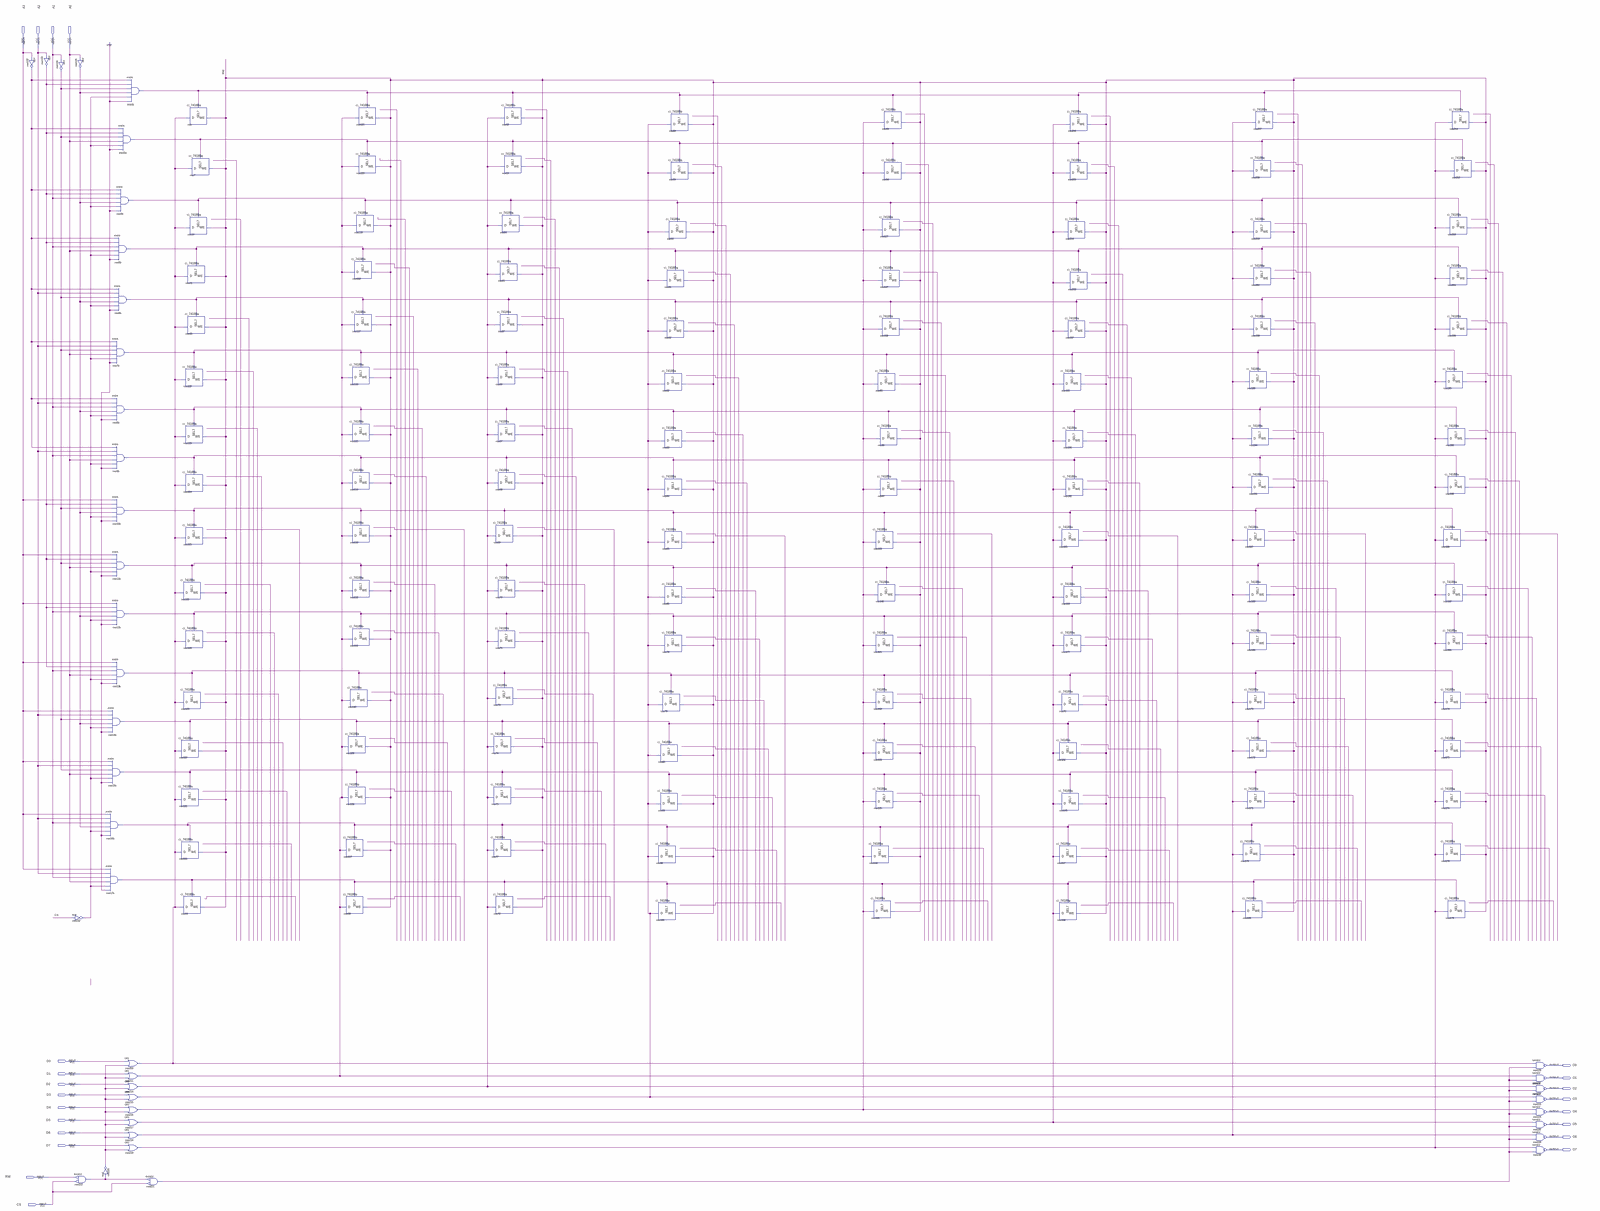
[diagram p0: schematic sheet, whole]
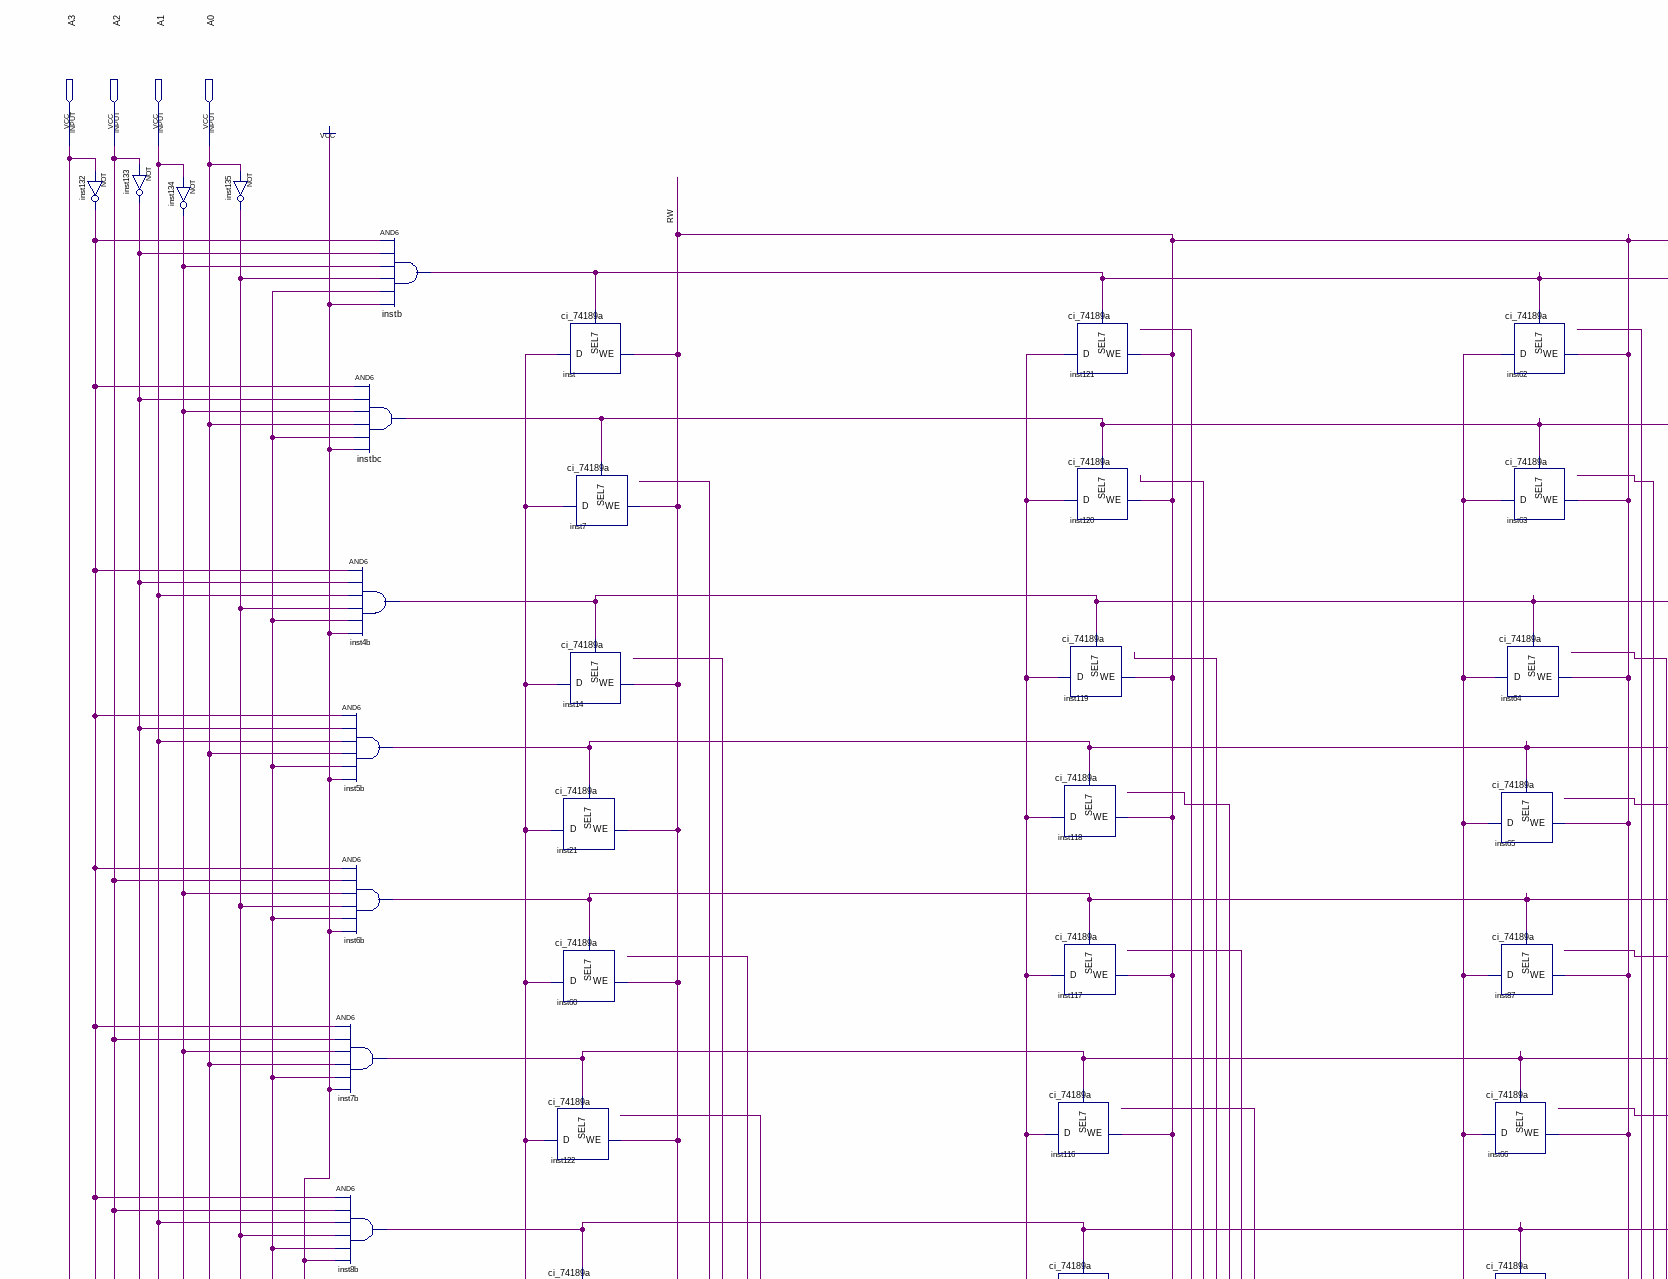
[diagram p1: schematic sheet, upper left part]
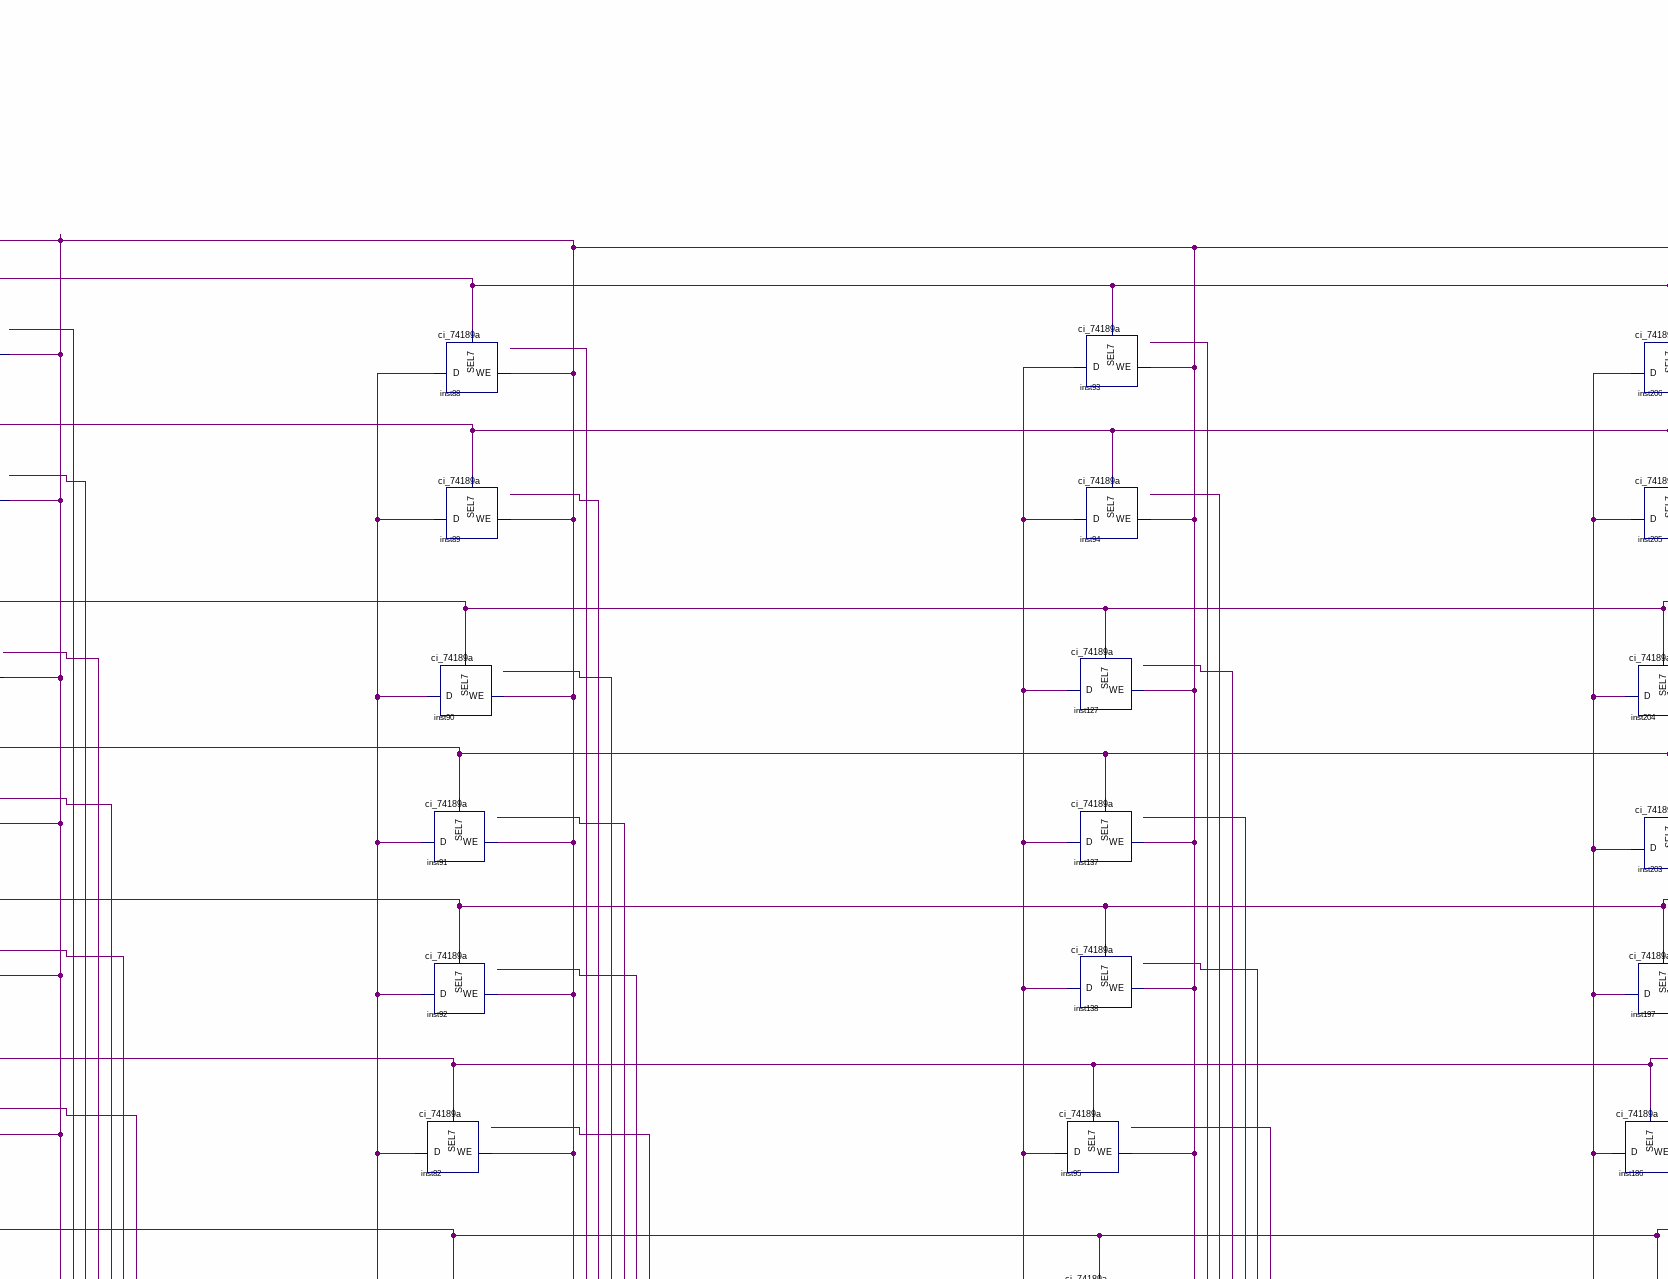
[diagram p2: schematic sheet, upper centre part]
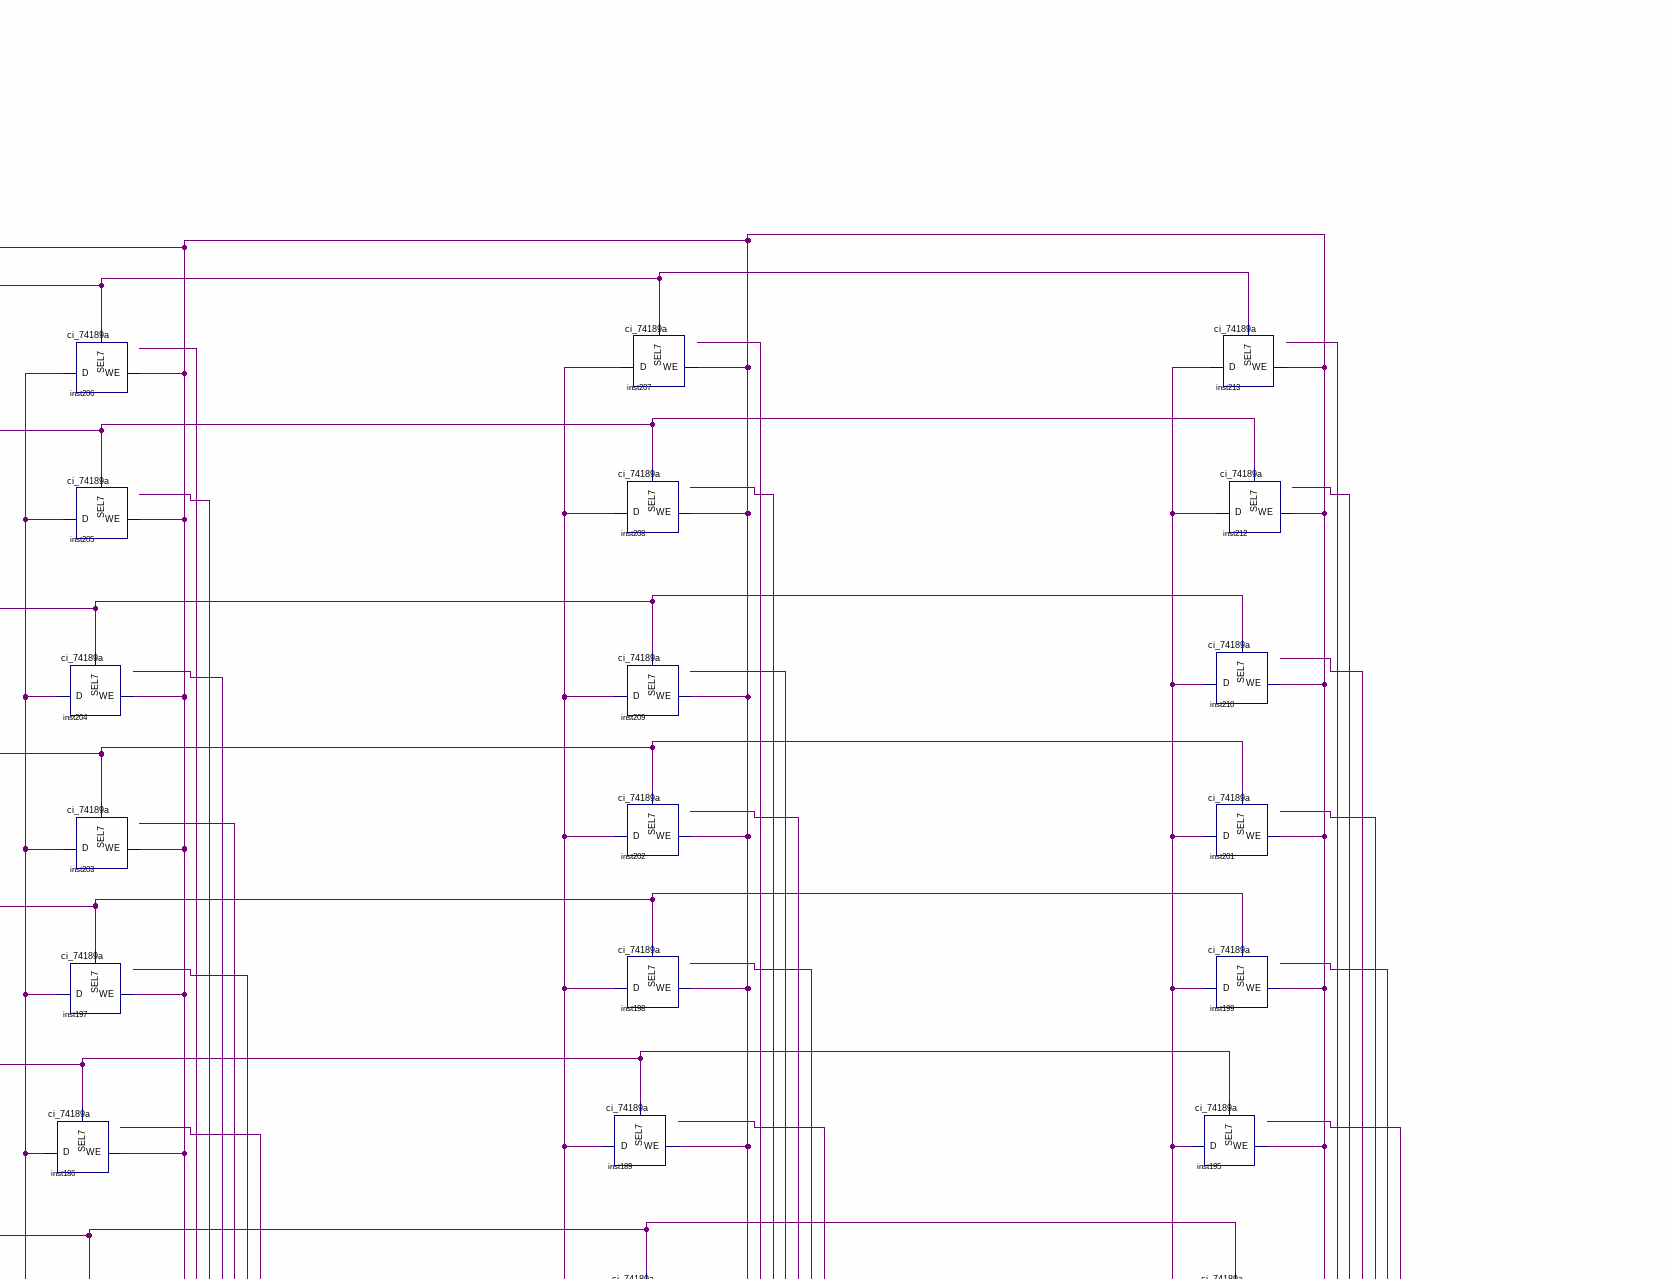
[diagram p3: schematic sheet, upper right part]
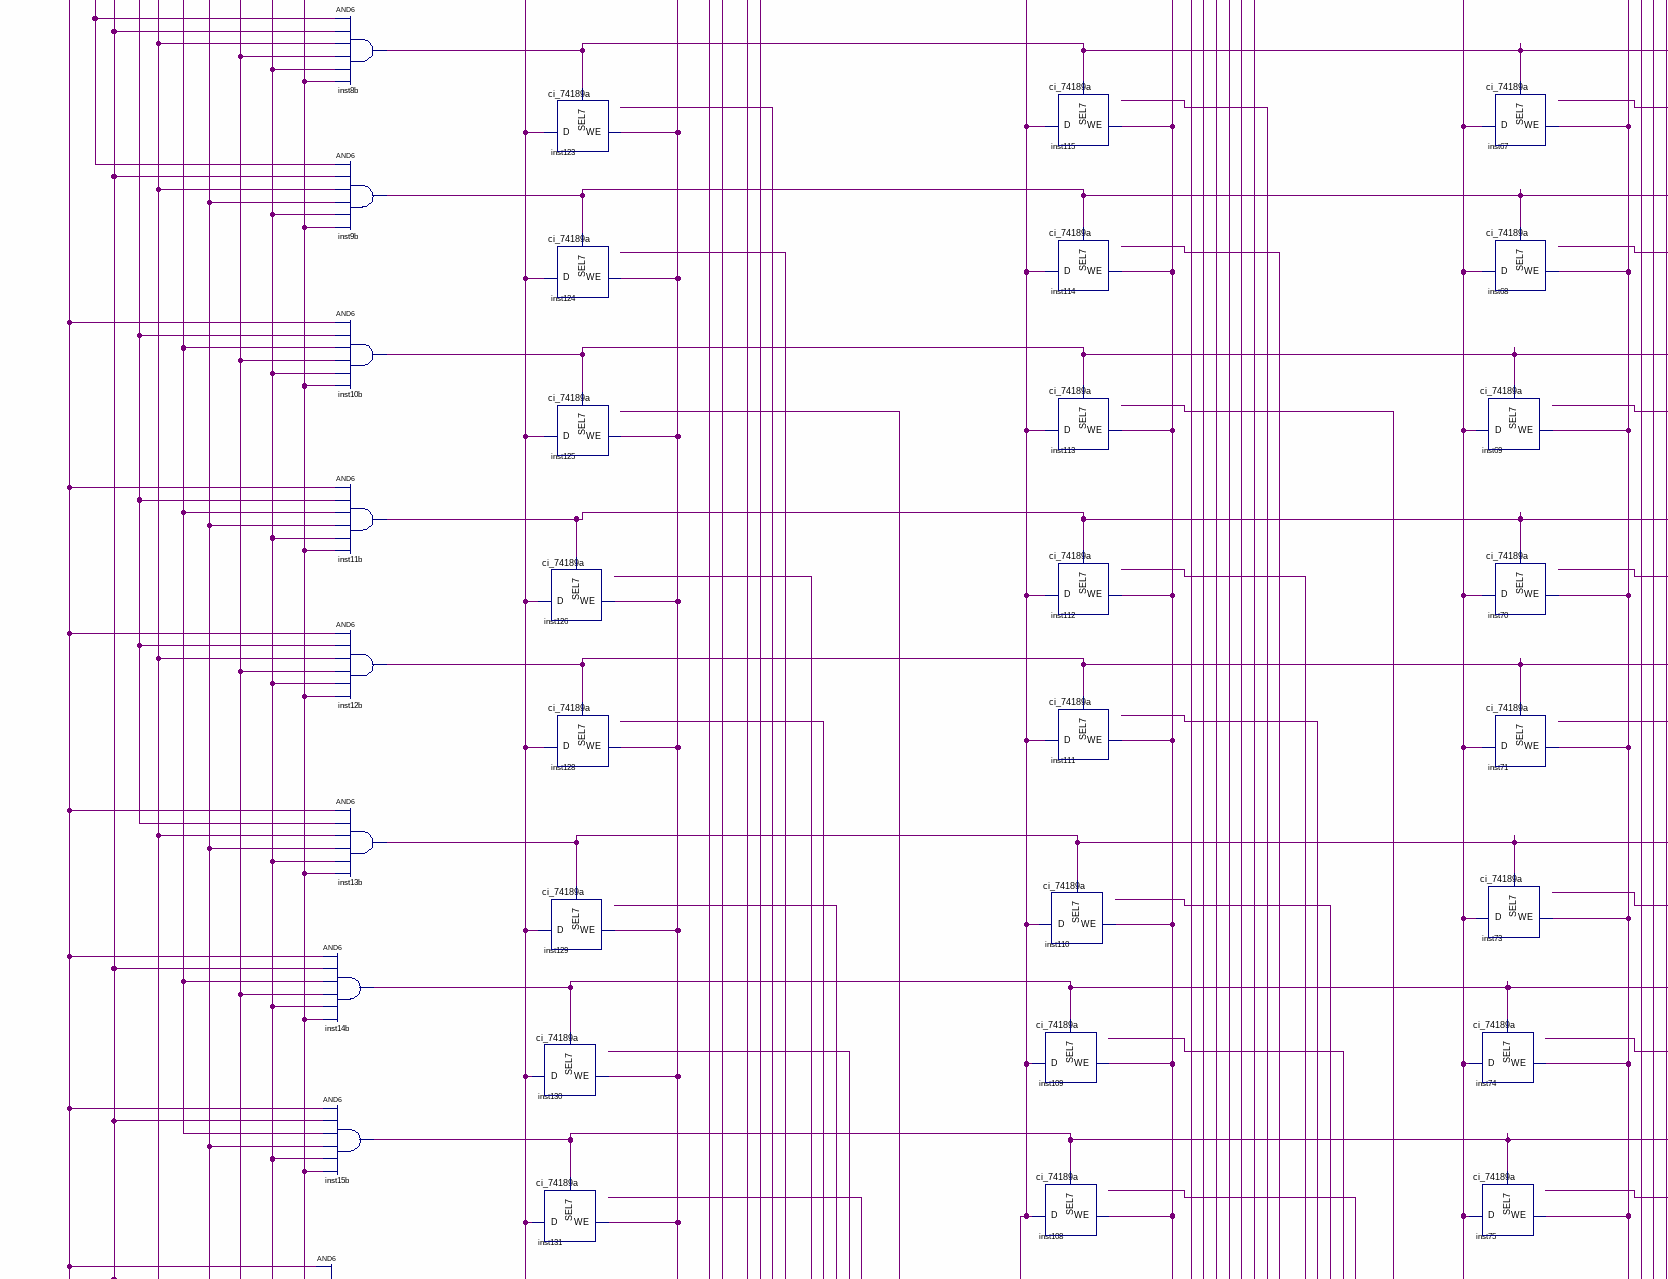
[diagram p4: schematic sheet, middle left part]
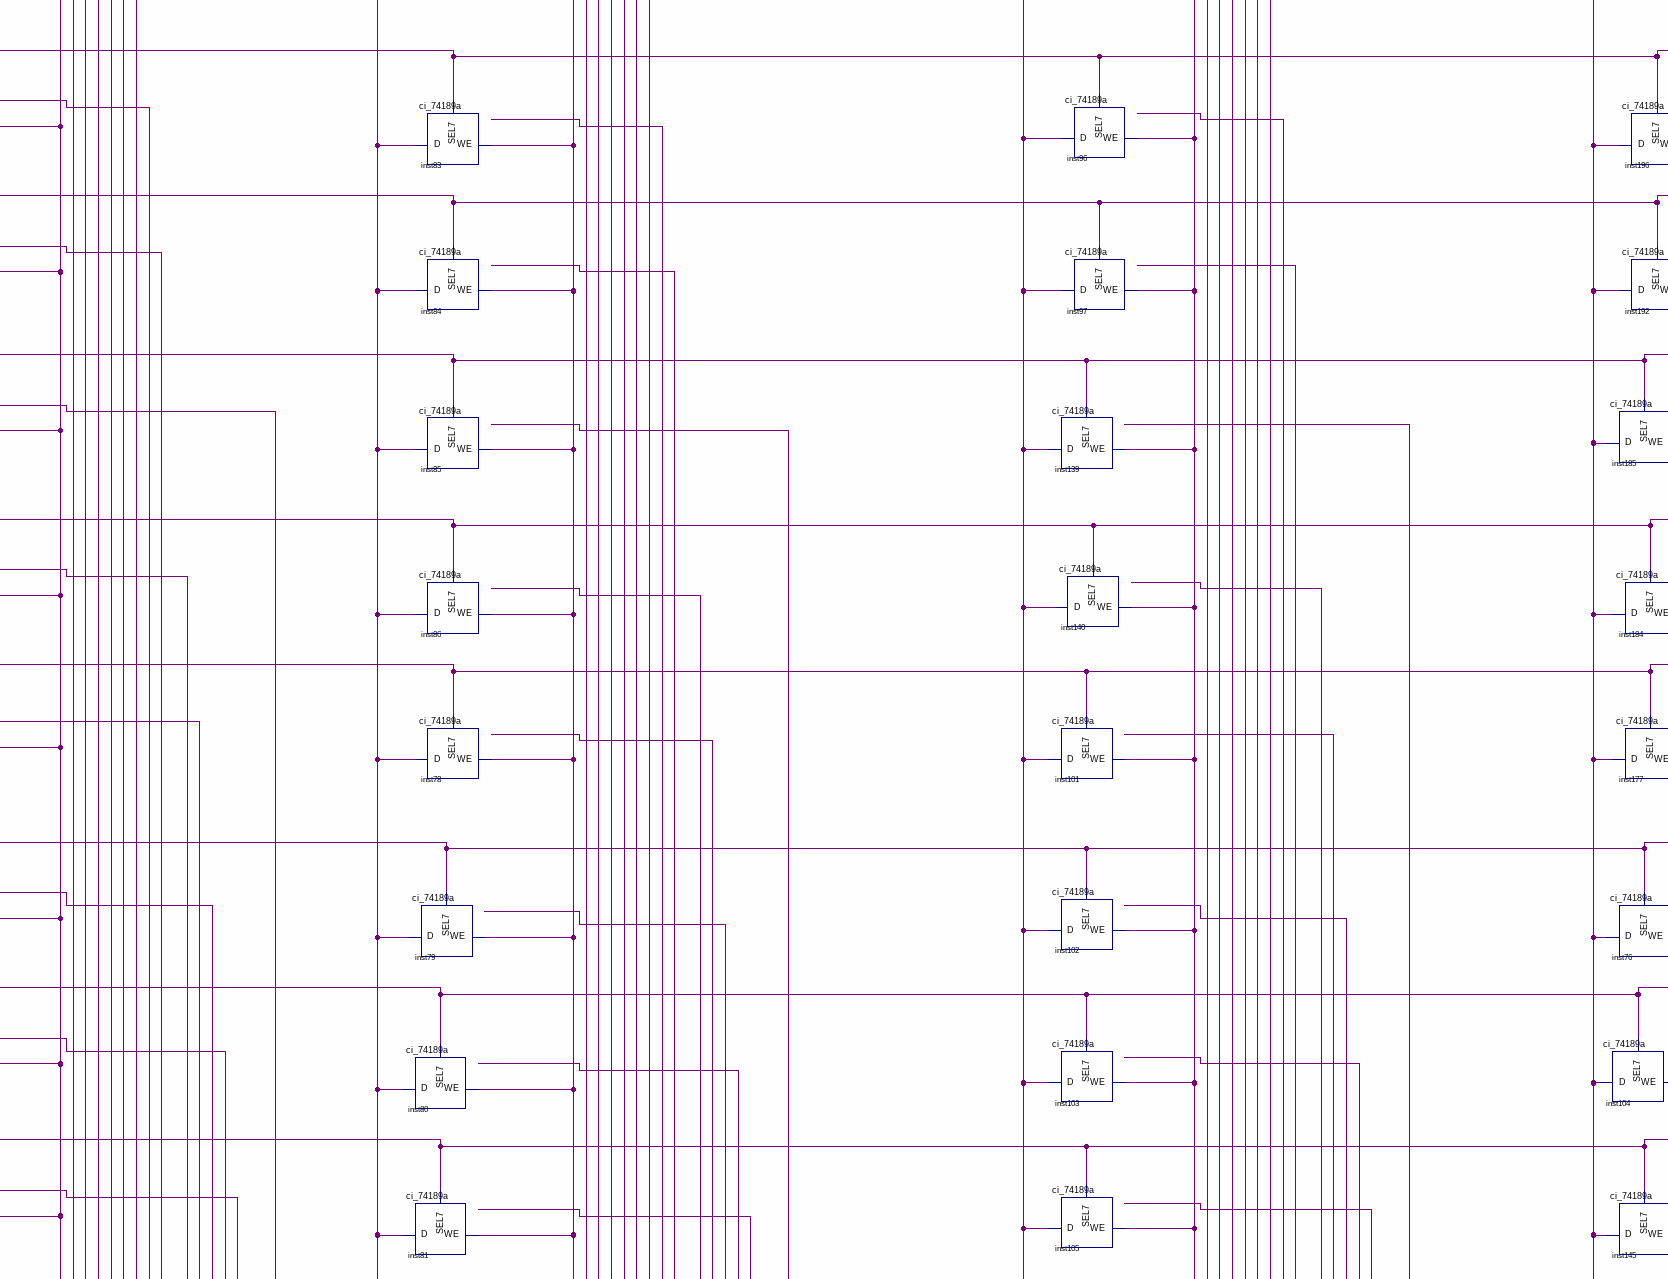
[diagram p5: schematic sheet, middle centre part]
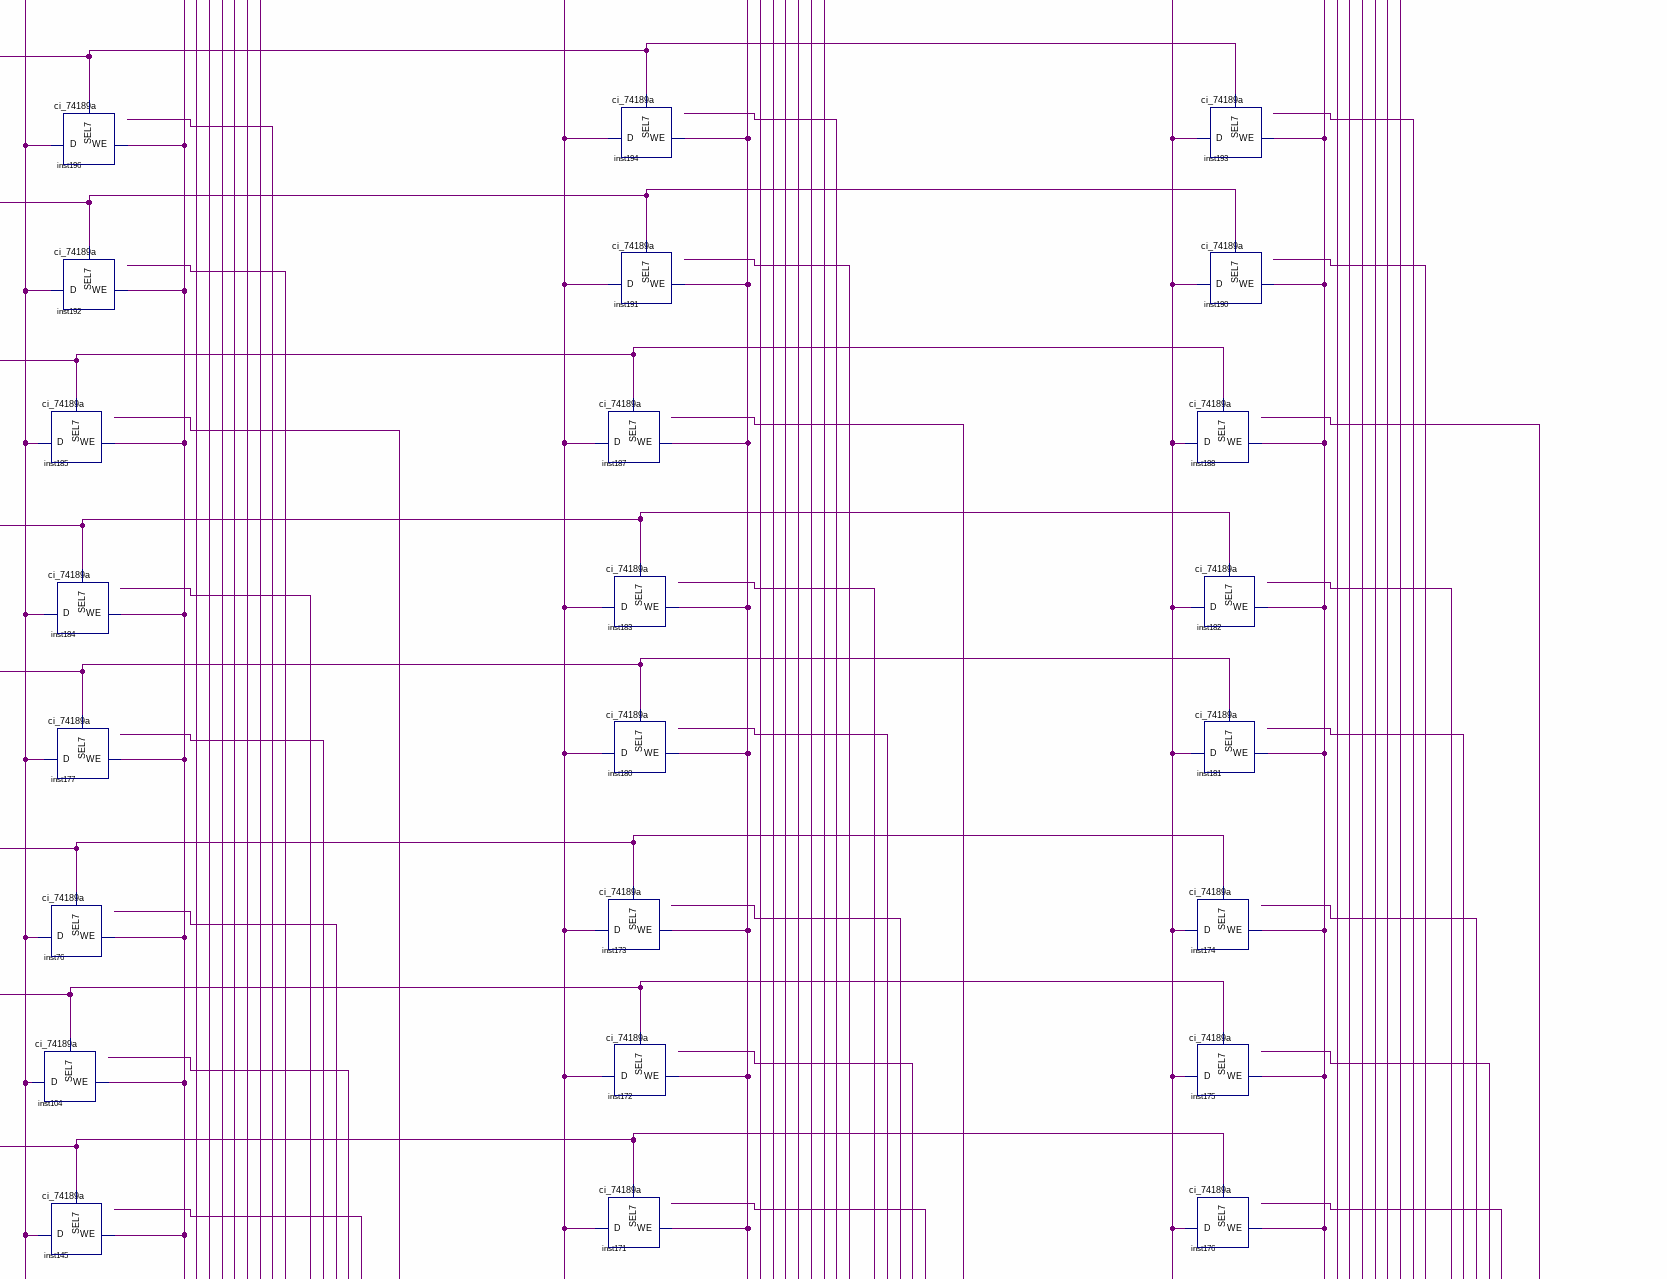
[diagram p6: schematic sheet, middle right part]
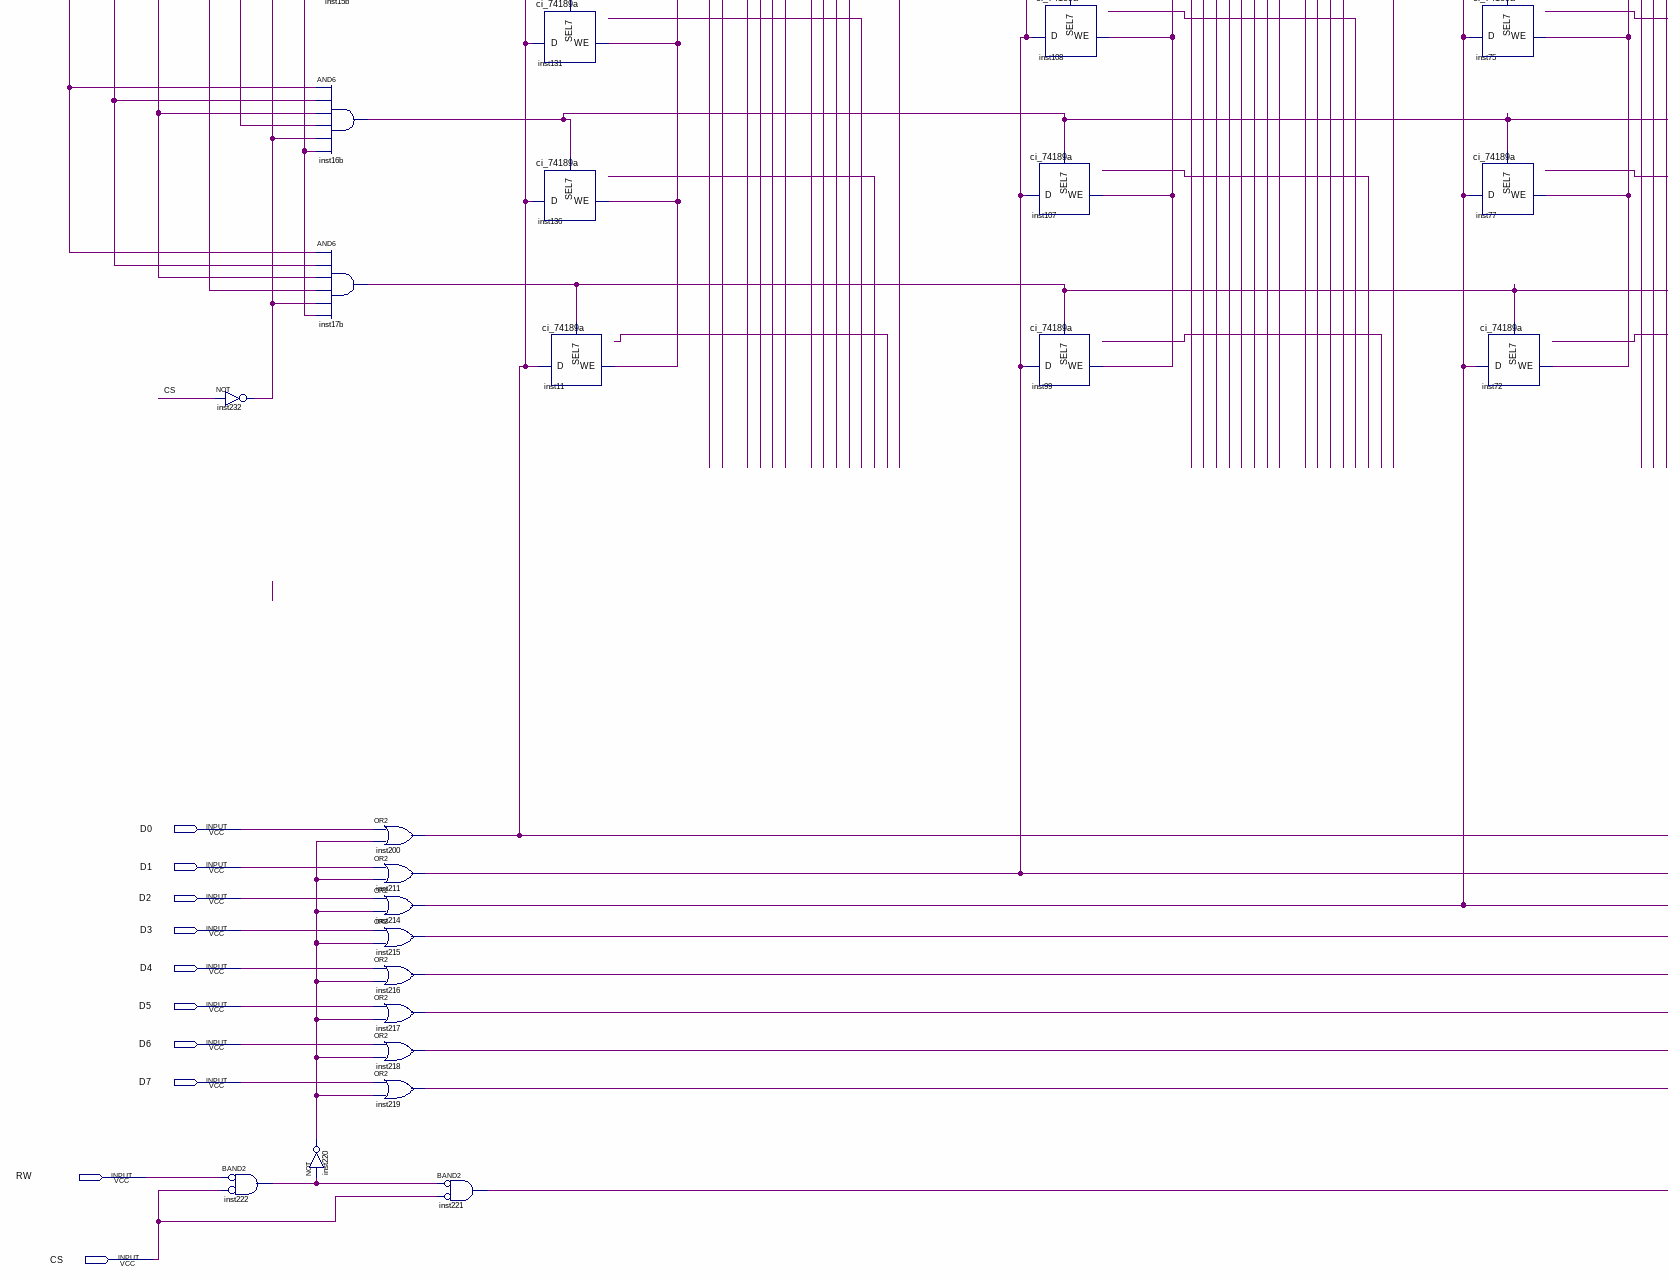
[diagram p7: schematic sheet, lower left part]
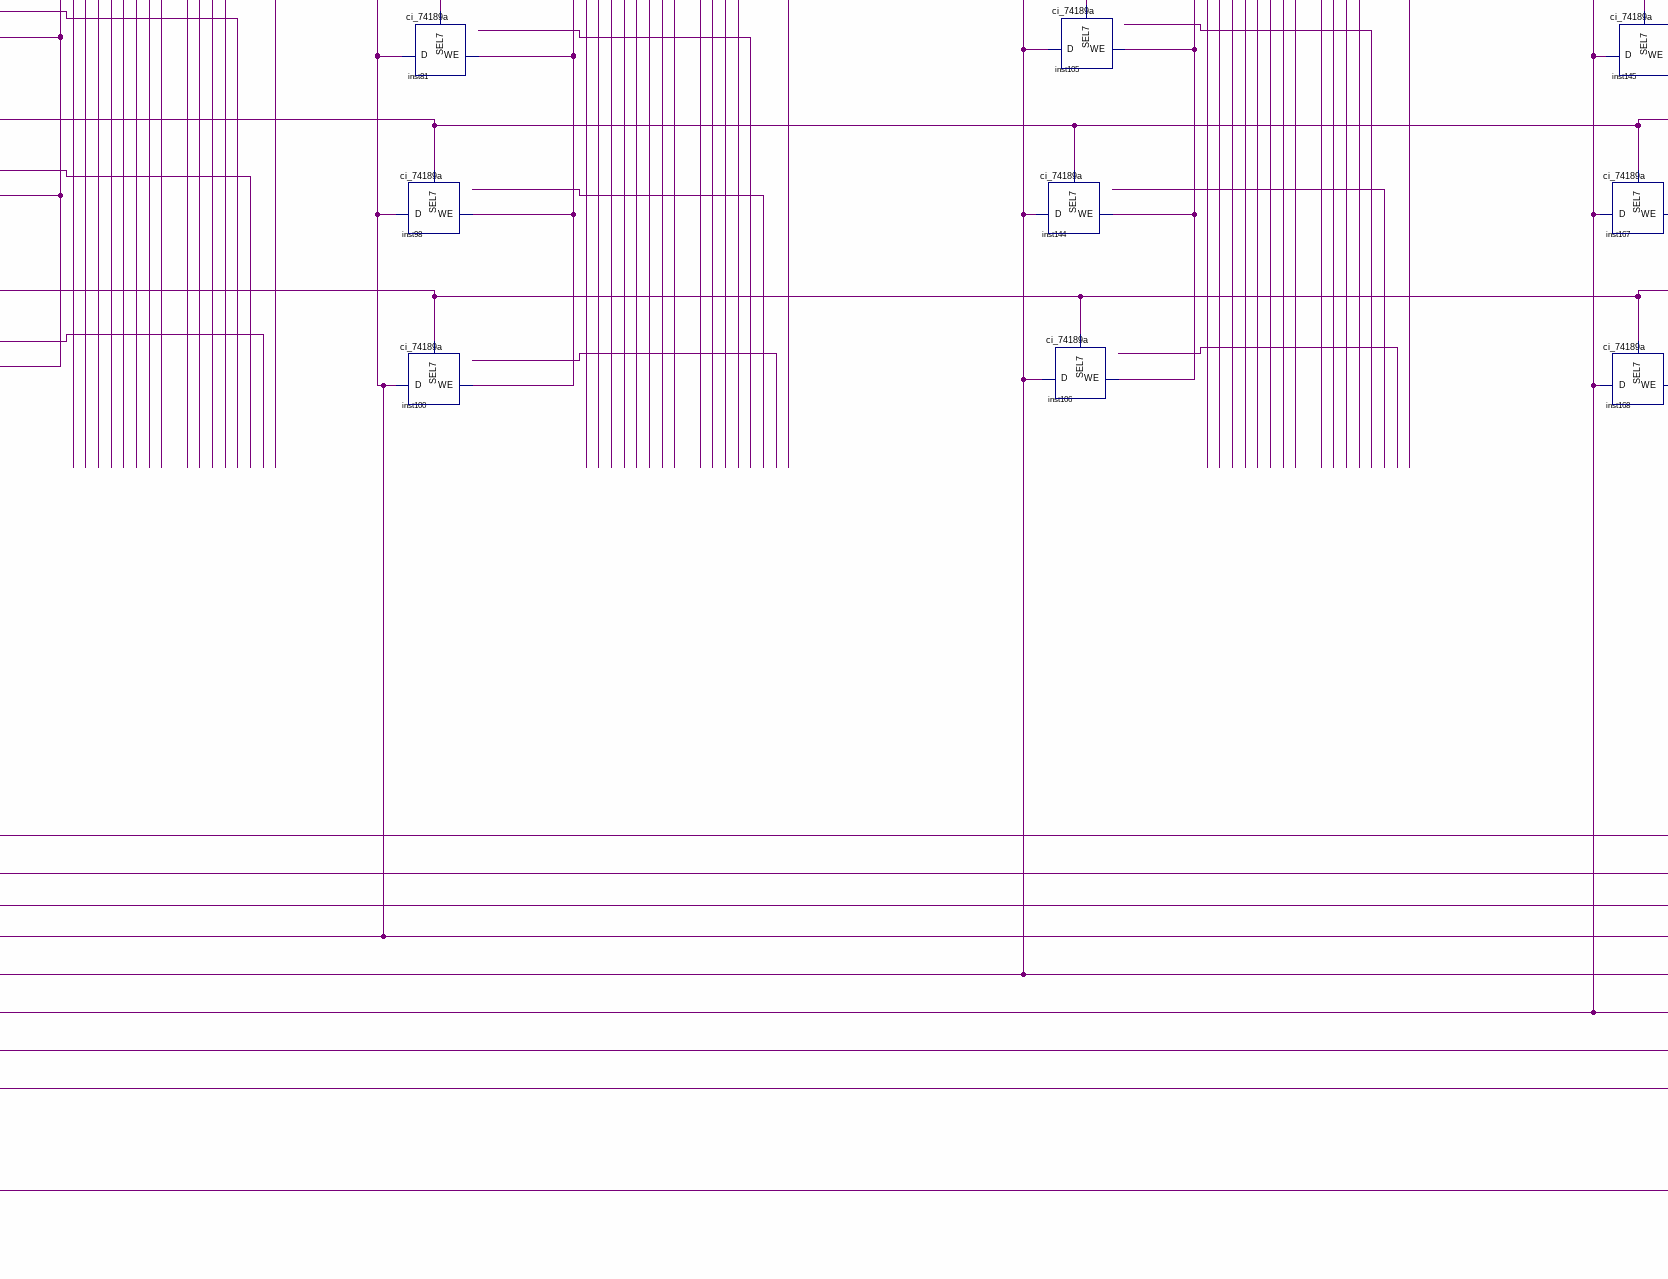
[diagram p8: schematic sheet, lower centre part]
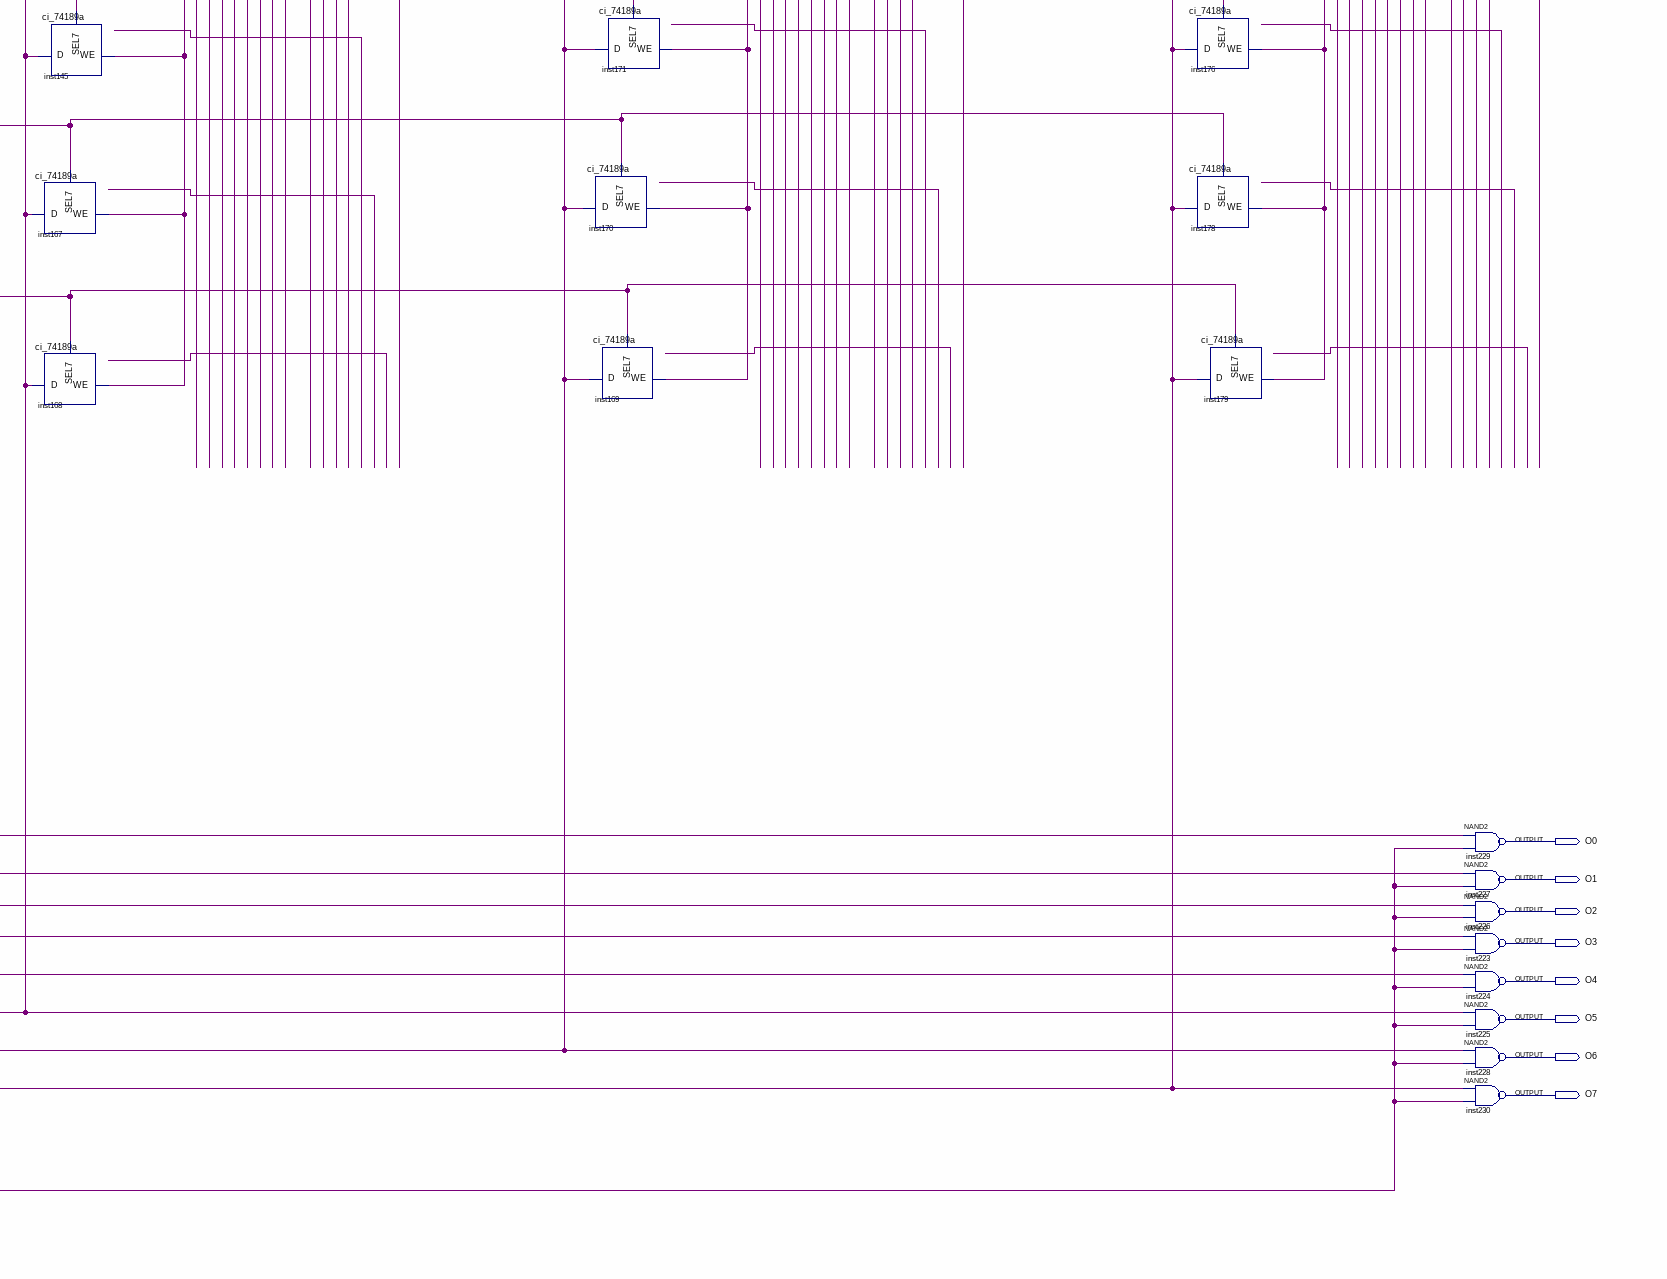
[diagram p9: schematic sheet, lower right part]
// Quartus schematic ram16x8a.bdf as structural Verilog: 168 symbols, 22 pins
module ram16x8a (
  input  A3,
  input  A2,
  input  A1,
  input  A0,
  input  D0,
  input  D1,
  input  D2,
  input  D3,
  input  D4,
  input  D5,
  input  D6,
  input  D7,
  input  RW,
  input  CS,
  output O0,
  output O1,
  output O2,
  output O3,
  output O4,
  output O5,
  output O6,
  output O7
);

  wire inst4b_out, inst5b_out, inst6b_out, inst7b_out, inst8b_out, inst9b_out, inst10b_out, inst11b_out,
       inst12b_out, inst13b_out, inst14b_out, inst15b_out, inst16b_out, inst17b_out, inst132_out,
       inst133_out, inst134_out, inst135_out, inst200_out, inst211_out, inst214_out, inst215_out,
       inst216_out, inst217_out, inst218_out, inst219_out, inst220_out, inst221_out, inst222_out,
       inst232_out, instb_out, instbc_out;

  not inst132 (inst132_out, A3);
  not inst133 (inst133_out, A2);
  not inst134 (inst134_out, A1);
  not inst135 (inst135_out, A0);
  not inst232 (inst232_out, CS);
  and inst222 (inst222_out, ~RW, ~CS);  // BAND2
  and inst4b (inst4b_out, inst132_out, inst133_out, A1, inst135_out, inst232_out, 1'b1);
  and inst5b (inst5b_out, inst132_out, inst133_out, A1, A0, inst232_out, 1'b1);
  and inst6b (inst6b_out, inst132_out, A2, inst134_out, inst135_out, inst232_out, 1'b1);
  and inst7b (inst7b_out, inst132_out, A2, inst134_out, A0, inst232_out, 1'b1);
  and inst8b (inst8b_out, inst132_out, A2, A1, inst135_out, inst232_out, 1'b1);
  and inst9b (inst9b_out, inst132_out, A2, A1, A0, inst232_out, 1'b1);
  and inst10b (inst10b_out, A3, inst133_out, inst134_out, inst135_out, inst232_out, 1'b1);
  and inst11b (inst11b_out, A3, inst133_out, inst134_out, A0, inst232_out, 1'b1);
  and inst12b (inst12b_out, A3, inst133_out, A1, inst135_out, inst232_out, 1'b1);
  and inst13b (inst13b_out, A3, inst133_out, A1, A0, inst232_out, 1'b1);
  and inst14b (inst14b_out, A3, A2, inst134_out, inst135_out, inst232_out, 1'b1);
  and inst15b (inst15b_out, A3, A2, inst134_out, A0, inst232_out, 1'b1);
  and inst16b (inst16b_out, A3, A2, A1, inst135_out, inst232_out, 1'b1);
  and inst17b (inst17b_out, A3, A2, A1, A0, inst232_out, 1'b1);
  not inst220 (inst220_out, inst222_out);
  and instb (instb_out, inst132_out, inst133_out, inst134_out, inst135_out, inst232_out, 1'b1);
  and instbc (instbc_out, inst132_out, inst133_out, inst134_out, A0, inst232_out, 1'b1);
  or inst200 (inst200_out, D0, inst220_out);
  or inst211 (inst211_out, D1, inst220_out);
  or inst214 (inst214_out, D2, inst220_out);
  or inst215 (inst215_out, D3, inst220_out);
  or inst216 (inst216_out, D4, inst220_out);
  or inst217 (inst217_out, D5, inst220_out);
  or inst218 (inst218_out, D6, inst220_out);
  or inst219 (inst219_out, D7, inst220_out);
  and inst221 (inst221_out, ~inst222_out, ~CS);  // BAND2
  ci_74189a inst21 (.WE(RW), .SEL7(inst5b_out), .D(inst200_out));
  ci_74189a inst60 (.WE(RW), .SEL7(inst6b_out), .D(inst200_out));
  ci_74189a inst122 (.WE(RW), .SEL7(inst7b_out), .D(inst200_out));
  ci_74189a inst123 (.WE(RW), .SEL7(inst8b_out), .D(inst200_out));
  ci_74189a inst124 (.WE(RW), .SEL7(inst9b_out), .D(inst200_out));
  ci_74189a inst125 (.WE(RW), .SEL7(inst10b_out), .D(inst200_out));
  ci_74189a inst126 (.WE(RW), .SEL7(inst11b_out), .D(inst200_out));
  ci_74189a inst128 (.WE(RW), .SEL7(inst12b_out), .D(inst200_out));
  ci_74189a inst129 (.WE(RW), .SEL7(inst13b_out), .D(inst200_out));
  ci_74189a inst130 (.WE(RW), .SEL7(inst14b_out), .D(inst200_out));
  ci_74189a inst131 (.WE(RW), .SEL7(inst15b_out), .D(inst200_out));
  ci_74189a inst136 (.WE(RW), .SEL7(inst16b_out), .D(inst200_out));
  ci_74189a inst11 (.WE(RW), .SEL7(inst17b_out), .D(inst200_out));
  ci_74189a inst (.WE(RW), .SEL7(instb_out), .D(inst200_out));
  ci_74189a inst7 (.WE(RW), .SEL7(instbc_out), .D(inst200_out));
  ci_74189a inst14 (.WE(RW), .SEL7(inst4b_out), .D(inst200_out));
  ci_74189a inst119 (.WE(RW), .SEL7(inst4b_out), .D(inst211_out));
  ci_74189a inst118 (.WE(RW), .SEL7(inst5b_out), .D(inst211_out));
  ci_74189a inst117 (.WE(RW), .SEL7(inst6b_out), .D(inst211_out));
  ci_74189a inst116 (.WE(RW), .SEL7(inst7b_out), .D(inst211_out));
  ci_74189a inst115 (.WE(RW), .SEL7(inst8b_out), .D(inst211_out));
  ci_74189a inst114 (.WE(RW), .SEL7(inst9b_out), .D(inst211_out));
  ci_74189a inst113 (.WE(RW), .SEL7(inst10b_out), .D(inst211_out));
  ci_74189a inst112 (.WE(RW), .SEL7(inst11b_out), .D(inst211_out));
  ci_74189a inst111 (.WE(RW), .SEL7(inst12b_out), .D(inst211_out));
  ci_74189a inst110 (.WE(RW), .SEL7(inst13b_out), .D(inst211_out));
  ci_74189a inst109 (.WE(RW), .SEL7(inst14b_out), .D(inst211_out));
  ci_74189a inst108 (.WE(RW), .SEL7(inst15b_out), .D(inst211_out));
  ci_74189a inst107 (.WE(RW), .SEL7(inst16b_out), .D(inst211_out));
  ci_74189a inst99 (.WE(RW), .SEL7(inst17b_out), .D(inst211_out));
  ci_74189a inst121 (.WE(RW), .SEL7(instb_out), .D(inst211_out));
  ci_74189a inst120 (.WE(RW), .SEL7(instbc_out), .D(inst211_out));
  ci_74189a inst62 (.WE(RW), .SEL7(instb_out), .D(inst214_out));
  ci_74189a inst63 (.WE(RW), .SEL7(instbc_out), .D(inst214_out));
  ci_74189a inst64 (.WE(RW), .SEL7(inst4b_out), .D(inst214_out));
  ci_74189a inst65 (.WE(RW), .SEL7(inst5b_out), .D(inst214_out));
  ci_74189a inst87 (.WE(RW), .SEL7(inst6b_out), .D(inst214_out));
  ci_74189a inst66 (.WE(RW), .SEL7(inst7b_out), .D(inst214_out));
  ci_74189a inst67 (.WE(RW), .SEL7(inst8b_out), .D(inst214_out));
  ci_74189a inst68 (.WE(RW), .SEL7(inst9b_out), .D(inst214_out));
  ci_74189a inst69 (.WE(RW), .SEL7(inst10b_out), .D(inst214_out));
  ci_74189a inst70 (.WE(RW), .SEL7(inst11b_out), .D(inst214_out));
  ci_74189a inst71 (.WE(RW), .SEL7(inst12b_out), .D(inst214_out));
  ci_74189a inst73 (.WE(RW), .SEL7(inst13b_out), .D(inst214_out));
  ci_74189a inst74 (.WE(RW), .SEL7(inst14b_out), .D(inst214_out));
  ci_74189a inst75 (.WE(RW), .SEL7(inst15b_out), .D(inst214_out));
  ci_74189a inst77 (.WE(RW), .SEL7(inst16b_out), .D(inst214_out));
  ci_74189a inst72 (.WE(RW), .SEL7(inst17b_out), .D(inst214_out));
  ci_74189a inst80 (.WE(RW), .SEL7(inst14b_out), .D(inst215_out));
  ci_74189a inst81 (.WE(RW), .SEL7(inst15b_out), .D(inst215_out));
  ci_74189a inst98 (.WE(RW), .SEL7(inst16b_out), .D(inst215_out));
  ci_74189a inst100 (.WE(RW), .SEL7(inst17b_out), .D(inst215_out));
  ci_74189a inst88 (.WE(RW), .SEL7(instb_out), .D(inst215_out));
  ci_74189a inst89 (.WE(RW), .SEL7(instbc_out), .D(inst215_out));
  ci_74189a inst90 (.WE(RW), .SEL7(inst4b_out), .D(inst215_out));
  ci_74189a inst91 (.WE(RW), .SEL7(inst5b_out), .D(inst215_out));
  ci_74189a inst92 (.WE(RW), .SEL7(inst6b_out), .D(inst215_out));
  ci_74189a inst82 (.WE(RW), .SEL7(inst7b_out), .D(inst215_out));
  ci_74189a inst83 (.WE(RW), .SEL7(inst8b_out), .D(inst215_out));
  ci_74189a inst84 (.WE(RW), .SEL7(inst9b_out), .D(inst215_out));
  ci_74189a inst85 (.WE(RW), .SEL7(inst10b_out), .D(inst215_out));
  ci_74189a inst86 (.WE(RW), .SEL7(inst11b_out), .D(inst215_out));
  ci_74189a inst78 (.WE(RW), .SEL7(inst12b_out), .D(inst215_out));
  ci_74189a inst79 (.WE(RW), .SEL7(inst13b_out), .D(inst215_out));
  ci_74189a inst95 (.WE(RW), .SEL7(inst7b_out), .D(inst216_out));
  ci_74189a inst96 (.WE(RW), .SEL7(inst8b_out), .D(inst216_out));
  ci_74189a inst97 (.WE(RW), .SEL7(inst9b_out), .D(inst216_out));
  ci_74189a inst139 (.WE(RW), .SEL7(inst10b_out), .D(inst216_out));
  ci_74189a inst140 (.WE(RW), .SEL7(inst11b_out), .D(inst216_out));
  ci_74189a inst101 (.WE(RW), .SEL7(inst12b_out), .D(inst216_out));
  ci_74189a inst102 (.WE(RW), .SEL7(inst13b_out), .D(inst216_out));
  ci_74189a inst103 (.WE(RW), .SEL7(inst14b_out), .D(inst216_out));
  ci_74189a inst105 (.WE(RW), .SEL7(inst15b_out), .D(inst216_out));
  ci_74189a inst144 (.WE(RW), .SEL7(inst16b_out), .D(inst216_out));
  ci_74189a inst106 (.WE(RW), .SEL7(inst17b_out), .D(inst216_out));
  ci_74189a inst93 (.WE(RW), .SEL7(instb_out), .D(inst216_out));
  ci_74189a inst94 (.WE(RW), .SEL7(instbc_out), .D(inst216_out));
  ci_74189a inst127 (.WE(RW), .SEL7(inst4b_out), .D(inst216_out));
  ci_74189a inst137 (.WE(RW), .SEL7(inst5b_out), .D(inst216_out));
  ci_74189a inst138 (.WE(RW), .SEL7(inst6b_out), .D(inst216_out));
  ci_74189a inst186 (.WE(RW), .SEL7(inst7b_out), .D(inst217_out));
  ci_74189a inst196 (.WE(RW), .SEL7(inst8b_out), .D(inst217_out));
  ci_74189a inst192 (.WE(RW), .SEL7(inst9b_out), .D(inst217_out));
  ci_74189a inst185 (.WE(RW), .SEL7(inst10b_out), .D(inst217_out));
  ci_74189a inst184 (.WE(RW), .SEL7(inst11b_out), .D(inst217_out));
  ci_74189a inst177 (.WE(RW), .SEL7(inst12b_out), .D(inst217_out));
  ci_74189a inst76 (.WE(RW), .SEL7(inst13b_out), .D(inst217_out));
  ci_74189a inst104 (.WE(RW), .SEL7(inst14b_out), .D(inst217_out));
  ci_74189a inst145 (.WE(RW), .SEL7(inst15b_out), .D(inst217_out));
  ci_74189a inst167 (.WE(RW), .SEL7(inst16b_out), .D(inst217_out));
  ci_74189a inst168 (.WE(RW), .SEL7(inst17b_out), .D(inst217_out));
  ci_74189a inst206 (.WE(RW), .SEL7(instb_out), .D(inst217_out));
  ci_74189a inst205 (.WE(RW), .SEL7(instbc_out), .D(inst217_out));
  ci_74189a inst204 (.WE(RW), .SEL7(inst4b_out), .D(inst217_out));
  ci_74189a inst203 (.WE(RW), .SEL7(inst5b_out), .D(inst217_out));
  ci_74189a inst197 (.WE(RW), .SEL7(inst6b_out), .D(inst217_out));
  ci_74189a inst189 (.WE(RW), .SEL7(inst7b_out), .D(inst218_out));
  ci_74189a inst194 (.WE(RW), .SEL7(inst8b_out), .D(inst218_out));
  ci_74189a inst191 (.WE(RW), .SEL7(inst9b_out), .D(inst218_out));
  ci_74189a inst187 (.WE(RW), .SEL7(inst10b_out), .D(inst218_out));
  ci_74189a inst183 (.WE(RW), .SEL7(inst11b_out), .D(inst218_out));
  ci_74189a inst180 (.WE(RW), .SEL7(inst12b_out), .D(inst218_out));
  ci_74189a inst173 (.WE(RW), .SEL7(inst13b_out), .D(inst218_out));
  ci_74189a inst172 (.WE(RW), .SEL7(inst14b_out), .D(inst218_out));
  ci_74189a inst171 (.WE(RW), .SEL7(inst15b_out), .D(inst218_out));
  ci_74189a inst170 (.WE(RW), .SEL7(inst16b_out), .D(inst218_out));
  ci_74189a inst169 (.WE(RW), .SEL7(inst17b_out), .D(inst218_out));
  ci_74189a inst207 (.WE(RW), .SEL7(instb_out), .D(inst218_out));
  ci_74189a inst208 (.WE(RW), .SEL7(instbc_out), .D(inst218_out));
  ci_74189a inst209 (.WE(RW), .SEL7(inst4b_out), .D(inst218_out));
  ci_74189a inst202 (.WE(RW), .SEL7(inst5b_out), .D(inst218_out));
  ci_74189a inst198 (.WE(RW), .SEL7(inst6b_out), .D(inst218_out));
  ci_74189a inst213 (.WE(RW), .SEL7(instb_out), .D(inst219_out));
  ci_74189a inst212 (.WE(RW), .SEL7(instbc_out), .D(inst219_out));
  ci_74189a inst210 (.WE(RW), .SEL7(inst4b_out), .D(inst219_out));
  ci_74189a inst201 (.WE(RW), .SEL7(inst5b_out), .D(inst219_out));
  ci_74189a inst199 (.WE(RW), .SEL7(inst6b_out), .D(inst219_out));
  ci_74189a inst195 (.WE(RW), .SEL7(inst7b_out), .D(inst219_out));
  ci_74189a inst193 (.WE(RW), .SEL7(inst8b_out), .D(inst219_out));
  ci_74189a inst190 (.WE(RW), .SEL7(inst9b_out), .D(inst219_out));
  ci_74189a inst188 (.WE(RW), .SEL7(inst10b_out), .D(inst219_out));
  ci_74189a inst182 (.WE(RW), .SEL7(inst11b_out), .D(inst219_out));
  ci_74189a inst181 (.WE(RW), .SEL7(inst12b_out), .D(inst219_out));
  ci_74189a inst174 (.WE(RW), .SEL7(inst13b_out), .D(inst219_out));
  ci_74189a inst175 (.WE(RW), .SEL7(inst14b_out), .D(inst219_out));
  ci_74189a inst176 (.WE(RW), .SEL7(inst15b_out), .D(inst219_out));
  ci_74189a inst178 (.WE(RW), .SEL7(inst16b_out), .D(inst219_out));
  ci_74189a inst179 (.WE(RW), .SEL7(inst17b_out), .D(inst219_out));
  nand inst229 (O0, inst200_out, inst221_out);
  nand inst227 (O1, inst211_out, inst221_out);
  nand inst226 (O2, inst214_out, inst221_out);
  nand inst223 (O3, inst215_out, inst221_out);
  nand inst224 (O4, inst216_out, inst221_out);
  nand inst225 (O5, inst217_out, inst221_out);
  nand inst228 (O6, inst218_out, inst221_out);
  nand inst230 (O7, inst219_out, inst221_out);
endmodule
